# Altium schematic sheet IHM.SchDoc: Carte Découpe DMX
size A4
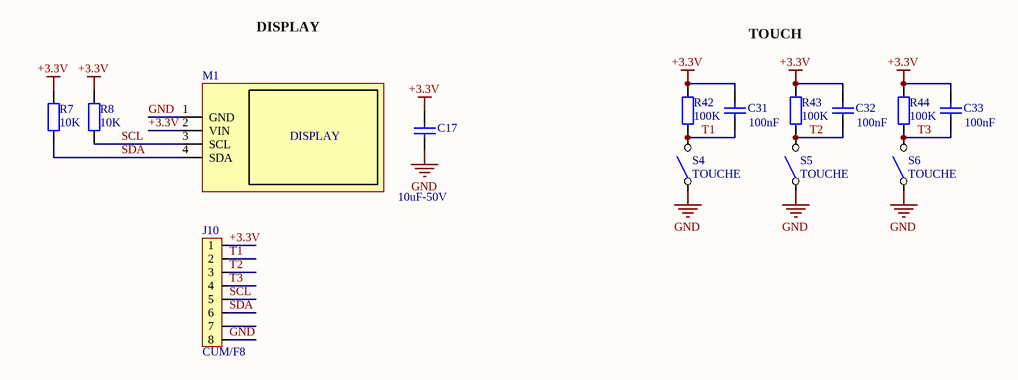
[diagram p0: IHM.SchDoc]

## Parts
C17  10uF-50V  [C1206]
C31  100nF  [C0603]
C32  100nF  [C0603]
C33  100nF  [C0603]
J10  CUM/F8  [BARF-2X4]
M1  (no value)  [I2C_OLED_0.96]
R7  10K  [R0603]
R8  10K  [R0603]
R42  100K  [R0603]
R43  100K  [R0603]
R44  100K  [R0603]
S4  TOUCHE  [INT-CMS1]
S5  TOUCHE  [INT-CMS1]
S6  TOUCHE  [INT-CMS1]

## Nets
+3.3V: C17.2 C31.2 C32.2 C33.2 J10.1 M1.2(VIN) R7.2 R8.2 R42.2 R43.2 R44.2
GND: C17.1 J10.8 M1.1(GND) S4.1 S5.1 S6.1
SCL: J10.5 M1.3(SCL) R8.1
SDA: J10.6 M1.4(SDA) R7.1
T1: C31.1 J10.2 R42.1 S4.4
T2: C32.1 J10.3 R43.1 S5.4
T3: C33.1 J10.4 R44.1 S6.4

Not connected (* = marked no-connect by the designer): J10 7

## Notes on the sheet
- DISPLAY
- TOUCH
- Title
- Size:
- Date:
- A4
- Number:
- Time:
- Revision:
- Sheet
- of
- File:
- (in symbol I2C-OLED-0.96) DISPLAY

## Library data of the parts
C17 C31-C33 = Cap: Capacitor
  C17: Value: 10uF-50V
  C31-C33: Value: 100nF
J10 = CUM/F8: connecteur 8 points
M1 = I2C-OLED-0.96: I2C OLED 0.96"
R7 R8 R42-R44 = Res: Thin Metal Film Resistor
  R7 R8: Value: 10K
  R42-R44: Value: 100K